# EasyEDA Pro project pet_dispenser.eprj

# Schematic Schematic1
Board Name: Board1; Create Date: 2026-09-30; Page Name: P1; Project Name: pet_dispenser; Schematic Name: Schematic1; Update Date: 2026-10-01; Company: EasyEDA.com; Page Size: A4; Version: V1.0
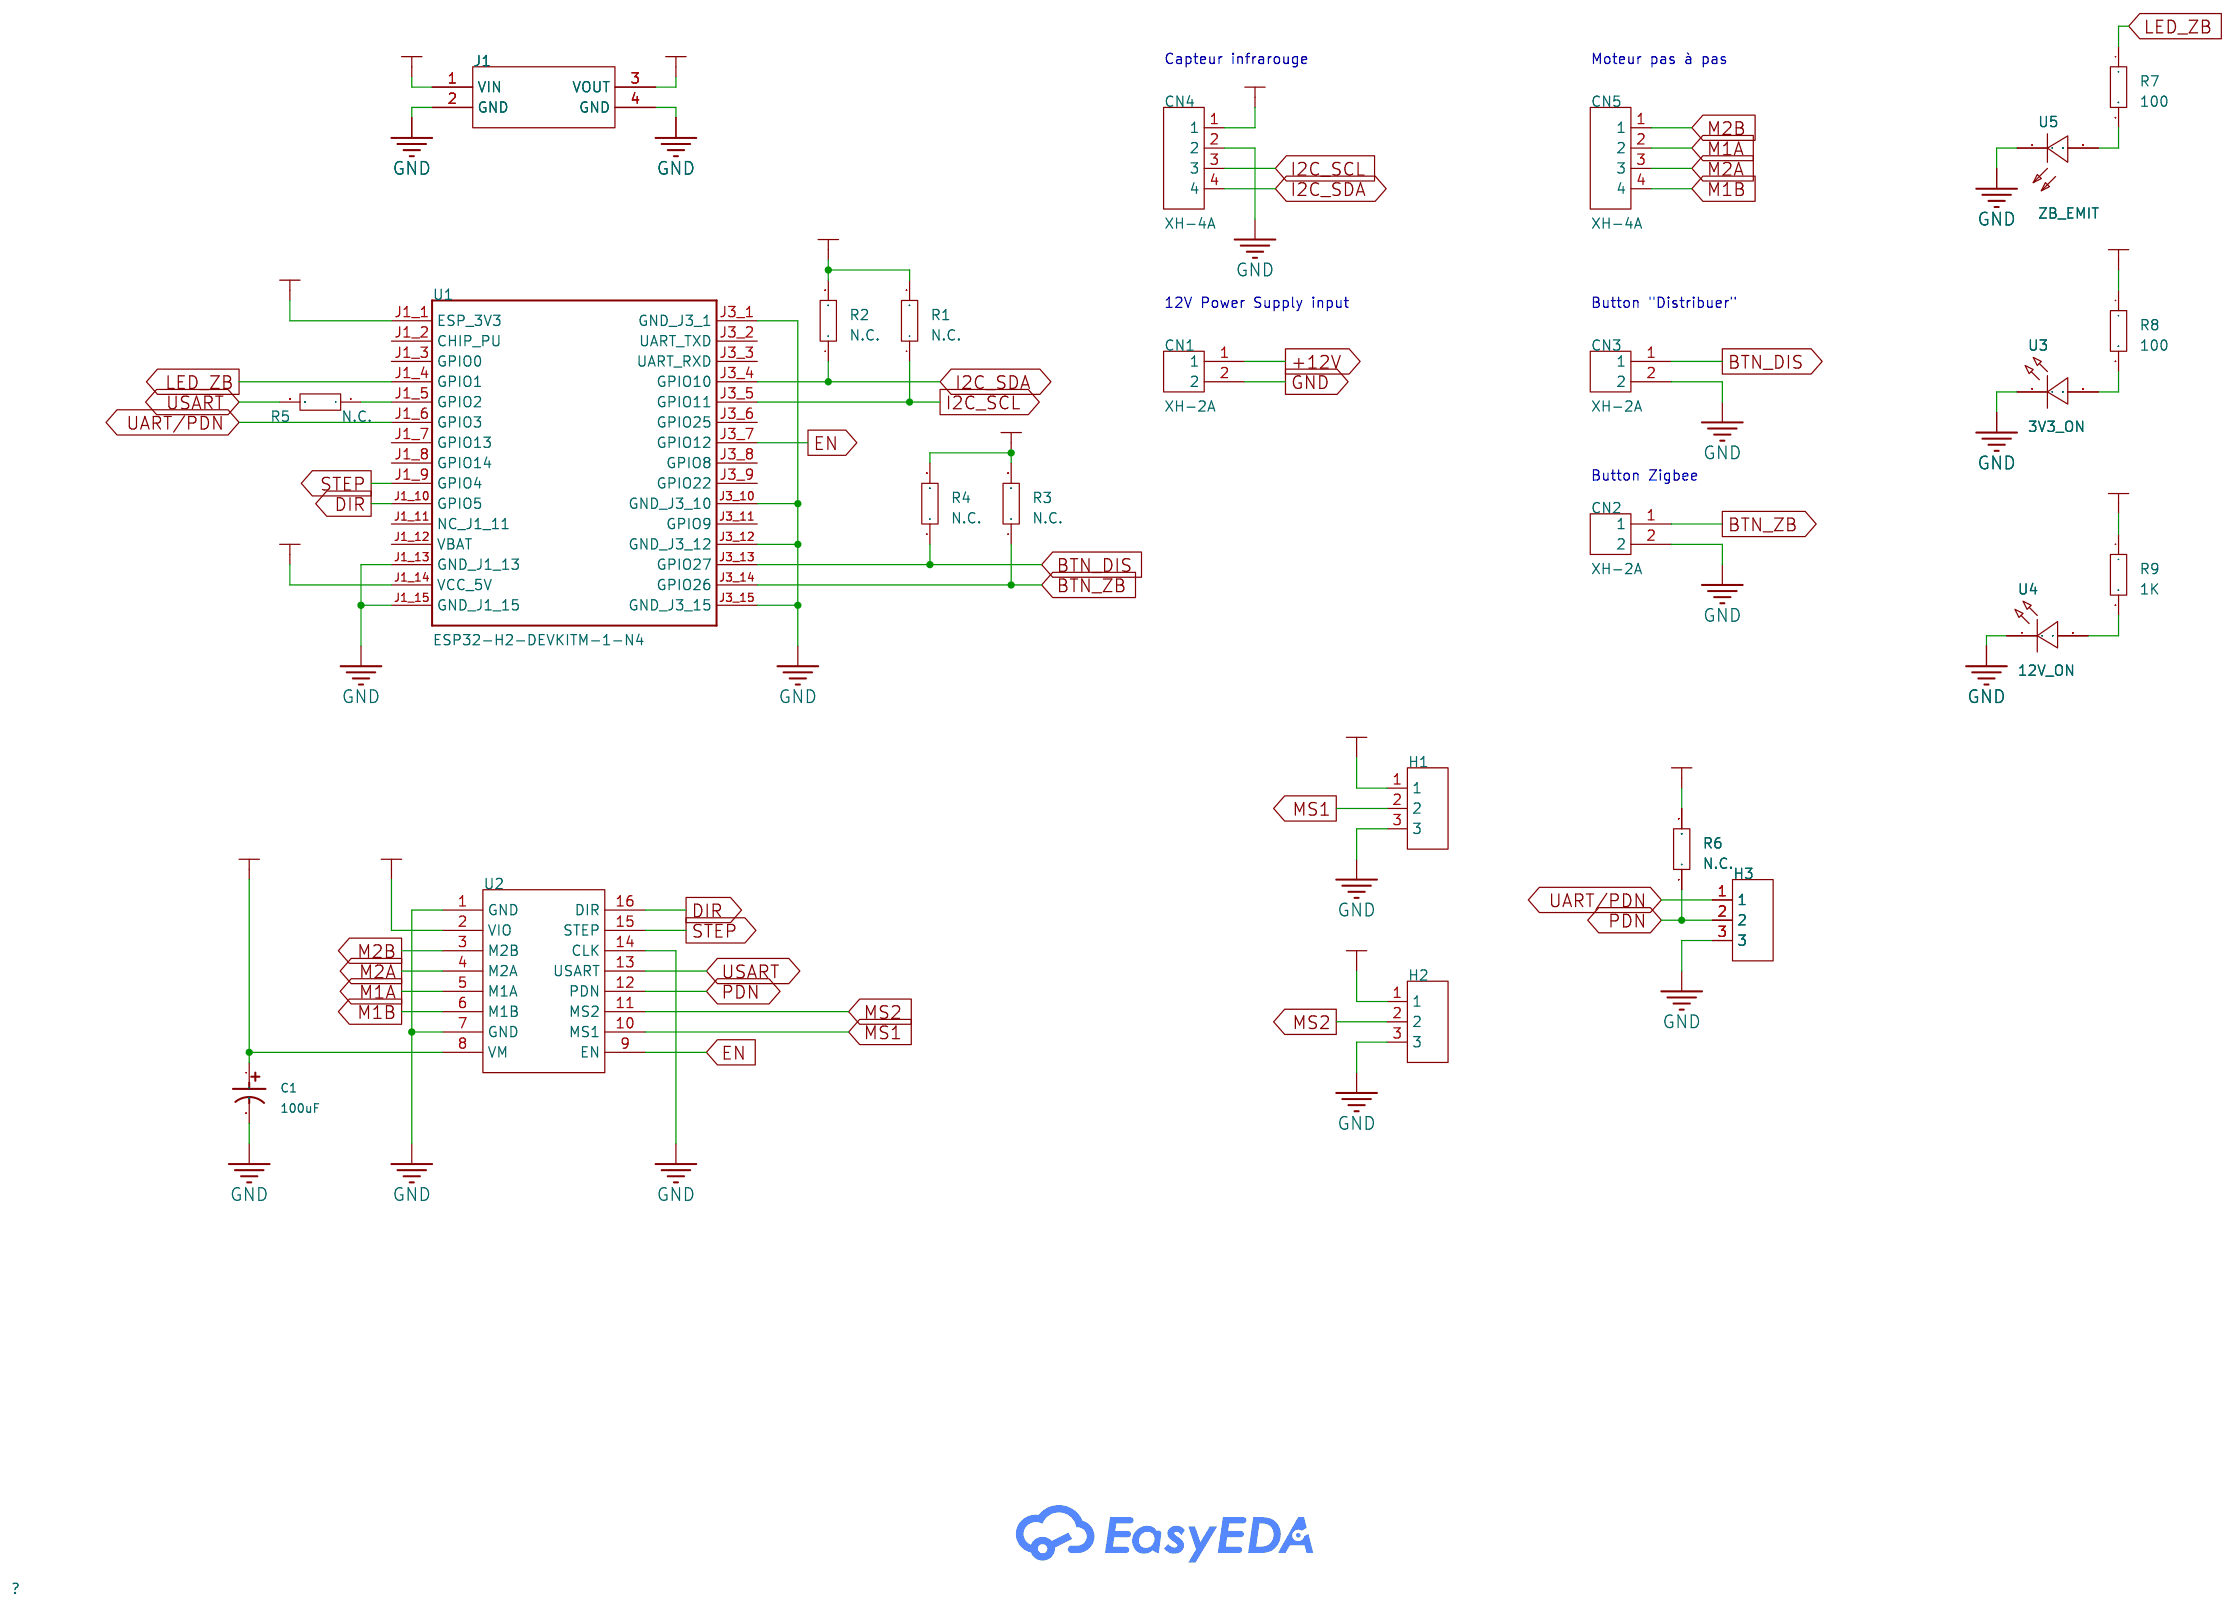
[diagram p0: schematic sheet]

## Parts
C1  100uF  [CAP-TH_BD8.0-P3.50-D0.6-FD-H12.0]
CN1  XH-2A  [CONN-TH_XH-2A]
CN2  XH-2A  [CONN-TH_XH-2A]
CN3  XH-2A  [CONN-TH_XH-2A]
CN4  XH-4A  [CONN-TH_4P-P2.50_4PIN]
CN5  XH-4A  [CONN-TH_4P-P2.50_4PIN]
H1  HX PH254-01-03-Z-L11.5 pcb pin header  [HDR-TH_3P-P2.54-V-M-1]
H2  HX PH254-01-03-Z-L11.5 pcb pin header  [HDR-TH_3P-P2.54-V-M-1]
H3  HX PH254-01-03-Z-L11.5 pcb pin header  [HDR-TH_3P-P2.54-V-M-1]
J1  -  [LM2596S]
R1  N.C.  [RES-TH_BD2.4-L6.3-P10.30-D0.6]
R2  N.C.  [RES-TH_BD2.4-L6.3-P10.30-D0.6]
R3  N.C.  [RES-TH_BD2.4-L6.3-P10.30-D0.6]
R4  N.C.  [RES-TH_BD2.4-L6.3-P10.30-D0.6]
R5  N.C.  [RES-TH_BD2.4-L6.3-P10.30-D0.6]
R6  N.C.  [RES-TH_BD2.4-L6.3-P10.30-D0.6]
R7  100  [RES-TH_BD2.4-L6.3-P10.30-D0.6]
R8  100  [RES-TH_BD2.4-L6.3-P10.30-D0.6]
R9  1K  [RES-TH_BD2.4-L6.3-P10.30-D0.6]
U1  ESP32-H2-DEVKITM-1-N4  [MODULE_ESP32-H2-DEVKITM-1-N4]
U2  -  [TMC2209-radiator]
U3  3V3_ON  [LED-TH_BD3.9-P2.54-RD]
U4  12V_ON  [LED-TH_BD3.9-P2.54-RD]
U5  ZB_EMIT  [LED-TH_BD4.0-P2.00-D0.5-RD_BULE]

## Library data of the parts
C1 = ERS1HM101F12OT: LCSC Part Name: 100uF ±20% 50V; Supplier Part: C112510; Manufacturer: AISHI(艾华集团); Supplier Footprint: 插件,D8xL12mm; JLCPCB Part Class: Extended Part; Datasheet: https://item.szlcsc.com/datasheet/ERS1HM101F12OT/113743.html; Supplier: LCSC; Tolerance: ±20%; Voltage Rating: 50V; Pin Spacing: 3.5mm; Diameter: 8mm; Height - Seated (Max): 12mm; Lifetime: 7000hrs@105℃
CN1-CN3 = XH-2A_C20079: LCSC Part Name: 1x2P 间距:2.5mm 直插 系列:XH; Supplier Part: C20079; Manufacturer: BOOMELE(博穆精密); Supplier Footprint: 插件,P=2.5mm; JLCPCB Part Class: Extended Part; Datasheet: https://item.szlcsc.com/datasheet/XH-2A/20789.html; Supplier: LCSC; Pins Structure: 1x2P; Pitch: 2.5mm; Mounting Type: Through Hole; Reference Series: XH; Number of Pins: 2P; Number of Rows: 1; Number of PINs Per Row: 2; Color: White; Z-Height of the Board: 7mm; X-Length of Bottom Edge on Board (Spacing Line): 7.5mm; Y-Width of Bottom Edge on Board: 5.8mm
CN4 CN5 = XH-4A_C53055480: LCSC Part Name: 1x4P 间距:2.54mm 直插 系列:XH; Supplier Part: C53055480; Manufacturer: LXWCONN(连兴旺电子); Supplier Footprint: 插件,P=2.5mm; JLCPCB Part Class: Extended Part; Datasheet: https://item.szlcsc.com/datasheet/XH-4A/55999680.html; Supplier: LCSC; Pins Structure: 1x4P; Pitch: 2.54mm; Mounting Type: Through Hole; Reference Series: XH; Number of Pins: 4P; Number of Rows: 1; Number of PINs Per Row: 4; Current Rating: 3A; Contact Material: Brass; Contact Plating: Tin; Operating Temperature: -25℃~+85℃; Voltage Rating: 250V; Plastic Material: PA66; Flame Retardant Rating: UL94V-0
H1-H3 = HX PH254-01-03-Z-L11.5 pcb pin header: LCSC Part Name: 1x3P 间距:2.54mm 方针 直插; Supplier Part: C52016391; Manufacturer: hanxia(韩下); Supplier Footprint: 插件,P=2.54mm; JLCPCB Part Class: Extended Part; Datasheet: https://item.szlcsc.com/datasheet/HX%2520PH254-01-03-Z-L11.5%2520pcb%2520pin%2520header/54760436.html; Supplier: LCSC; Pin Structure: 1x3P; Pitch: 2.54mm; Circluar Pins/Square Pins: Pin Header; Mounting Type: Through Hole; Number of Rows: 1; Number of Pins: 3P; Current Rating: 3A; Voltage Rating (Max): 1kV; Length of Mating Pin: 6mm; Insulation Height: 2.5mm; Length of End Connection Pin: 3mm; Contact Material: Brass; Contact Plating: Gold; Operating Temperature: -40℃~+105℃
J1 = LM2596S
R1-R9 = MFR-25FTE52-4K7: Type:Metal Film Resistors Resistance: Tolerance:±1% Tolerance:±1% Power(Watts):250mW Temperature Coefficient:±50ppm/℃ Temperature Coefficient:±50ppm/℃ Operating Temperature:-55℃~+155℃ Operating Temperature:-55℃~+155℃; LCSC Part Name: 金属膜电阻 4.7kΩ ±1% 250mW 铜脚，圆柱状直插; Supplier Part: C173023; Manufacturer: YAGEO(国巨); Supplier Footprint: 插件,D2.4xL6.3mm; JLCPCB Part Class: Extended Part; Datasheet: https://atta.szlcsc.com/upload/public/pdf/source/20191118/C457825_18355E864DE4965678DC27B0EBC3E21E.pdf; Supplier: LCSC; Type: Metal Film Resistors; Tolerance: ±1%; Power(Watts): 250mW; Temperature Coefficient: ±50ppm/℃; Operating Temperature: -55℃~+155℃
U1 = ESP32-H2-DEVKITM-1-N4
U2 = TMC2209-radiator
U3 U4 = greenled_m3: Supplier Part: C9900094809; Supplier Footprint: LED-TH_BD3.90-P2.54; JLCPCB Part Class: Extended Part; Supplier: LCSC
U5 = LED-DIP-3MM_Blue: Supplier Part: C9900002363; Supplier Footprint: LED-TH_BD4.1-P2.00; JLCPCB Part Class: Extended Part; Supplier: LCSC

## Nets
+3V3: CN4.1 H1.1 H2.1 R1.2 R2.2 R3.2 R4.2 R6.2 R8.1 U1.J1_1(ESP_3V3) U2.2(VIO)
+5V: J1.3(VOUT) U1.J1_14(VCC_5V)
+12V: C1.1 CN1.1 J1.1(VIN) R9.1 U2.8(VM)
GND: C1.2 CN1.2 CN2.2 CN3.2 CN4.2 H1.3 H2.3 H3.3 J1.2(GND) J1.4(GND) U1.J1_13(GND) U1.J1_15(GND) U1.J3_1(GND) U1.J3_10(GND) U1.J3_12(GND) U1.J3_15(GND) U2.1(GND) U2.7(GND) U2.14(CLK) U3.1 U4.1 U5.1
BTN_DIS: CN3.1 R4.1 U1.J3_13(GPIO27)
BTN_ZB: CN2.1 R3.1 U1.J3_14(GPIO26)
DIR: U1.J1_10(GPIO5) U2.16(DIR)
EN: U1.J3_7(GPIO12) U2.9(EN)
I2C_SCL: CN4.3 R1.1 U1.J3_5(GPIO11)
I2C_SDA: CN4.4 R2.1 U1.J3_4(GPIO10)
LED_ZB: R7.1 U1.J1_4(GPIO1)
M1A: CN5.2 U2.5(M1A)
M1B: CN5.4 U2.6(M1B)
M2A: CN5.3 U2.4(M2A)
M2B: CN5.1 U2.3(M2B)
MS1: H1.2 U2.10(MS1)
MS2: H2.2 U2.11(MS2)
PDN: H3.2 R6.1 U2.12(PDN)
STEP: U1.J1_9(GPIO4) U2.15(STEP)
UART/PDN: H3.1 U1.J1_6(GPIO3)
USART: R5.2 U2.13(USART)
$1N2665: R5.1 U1.J1_5(GPIO2)
$1N3525: R7.2 U5.2
$1N3546: R8.2 U3.2
$1N3565: R9.2 U4.2

Not connected (* = marked no-connect by the designer): U1 J1_2(CHIP_PU) J1_3(GPIO0) J1_7(GPIO13) J1_8(GPIO14) J1_11(NC) J1_12(VBAT) J3_2(UART_TXD) J3_3(UART_RXD) J3_6(GPIO25) J3_8(GPIO8) J3_9(GPIO22) J3_11(GPIO9)

## Notes on the sheet
- Capteur infrarouge
- Moteur pas à pas
- 12V Power Supply input
- Button "Distribuer"
- Button Zigbee

# Board PCB1
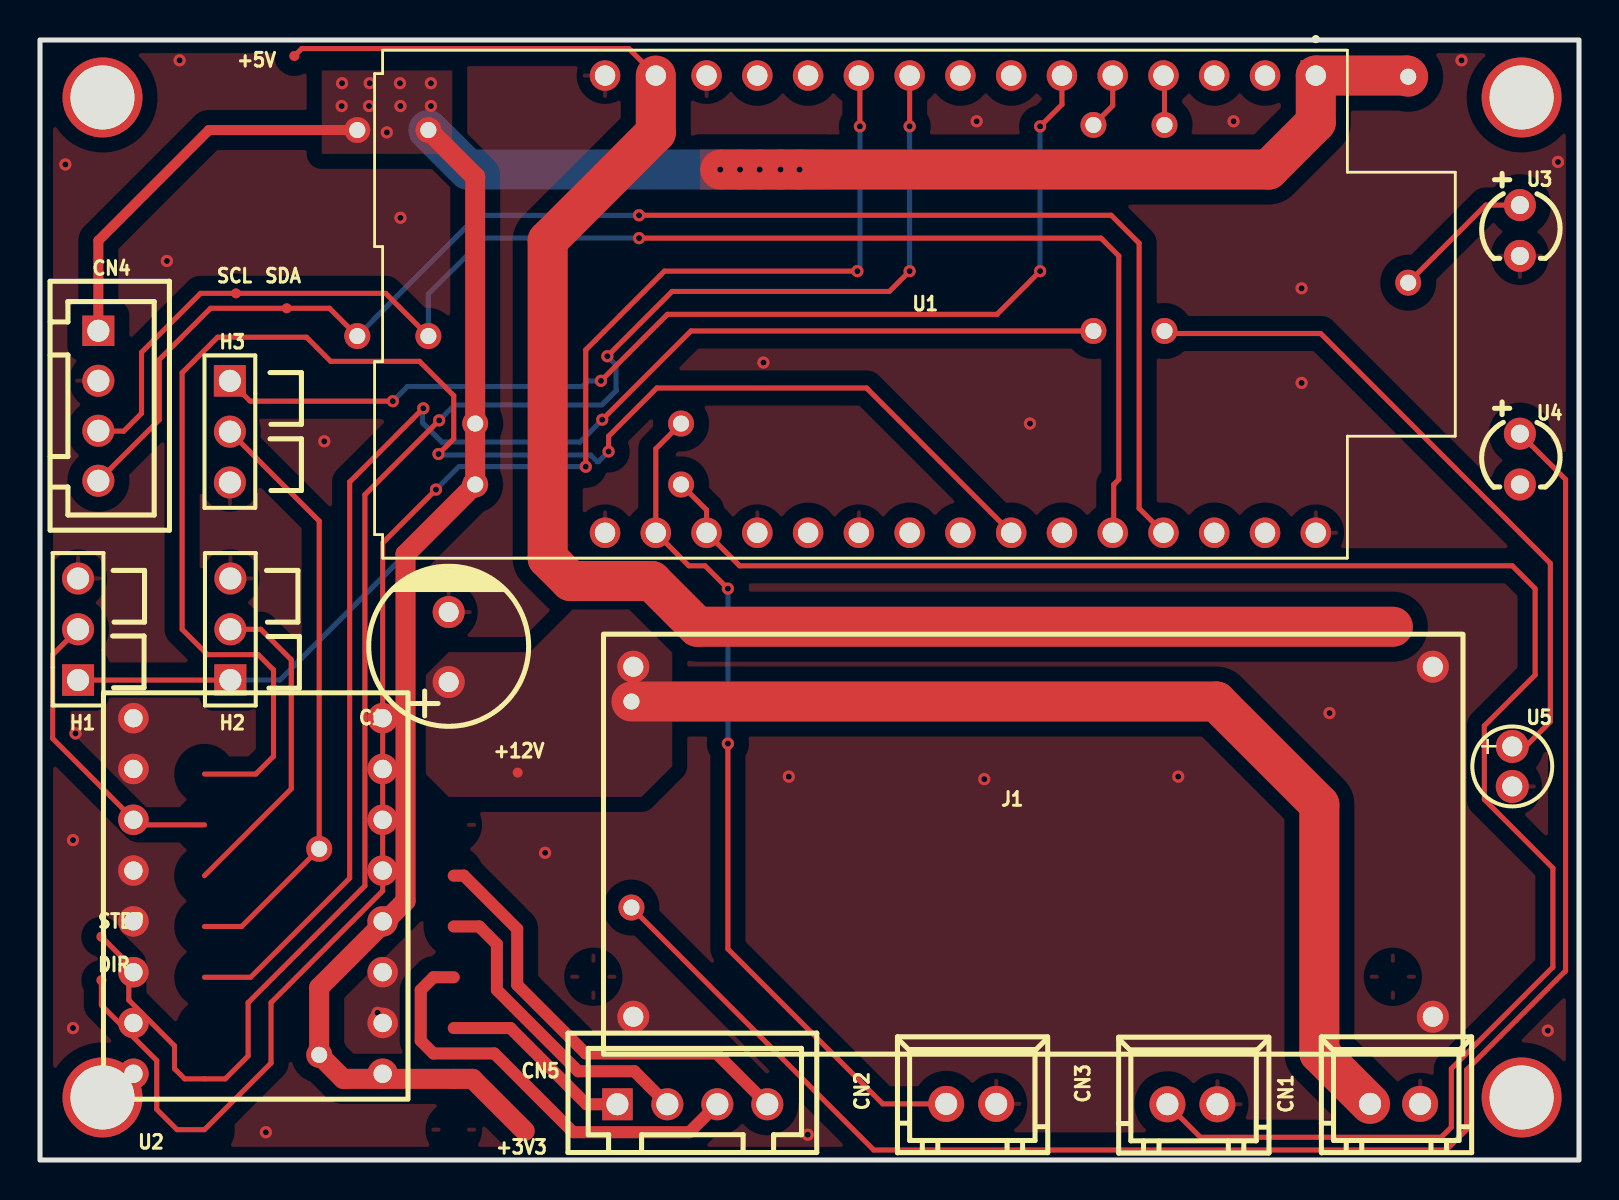
[diagram p1: board, top side]
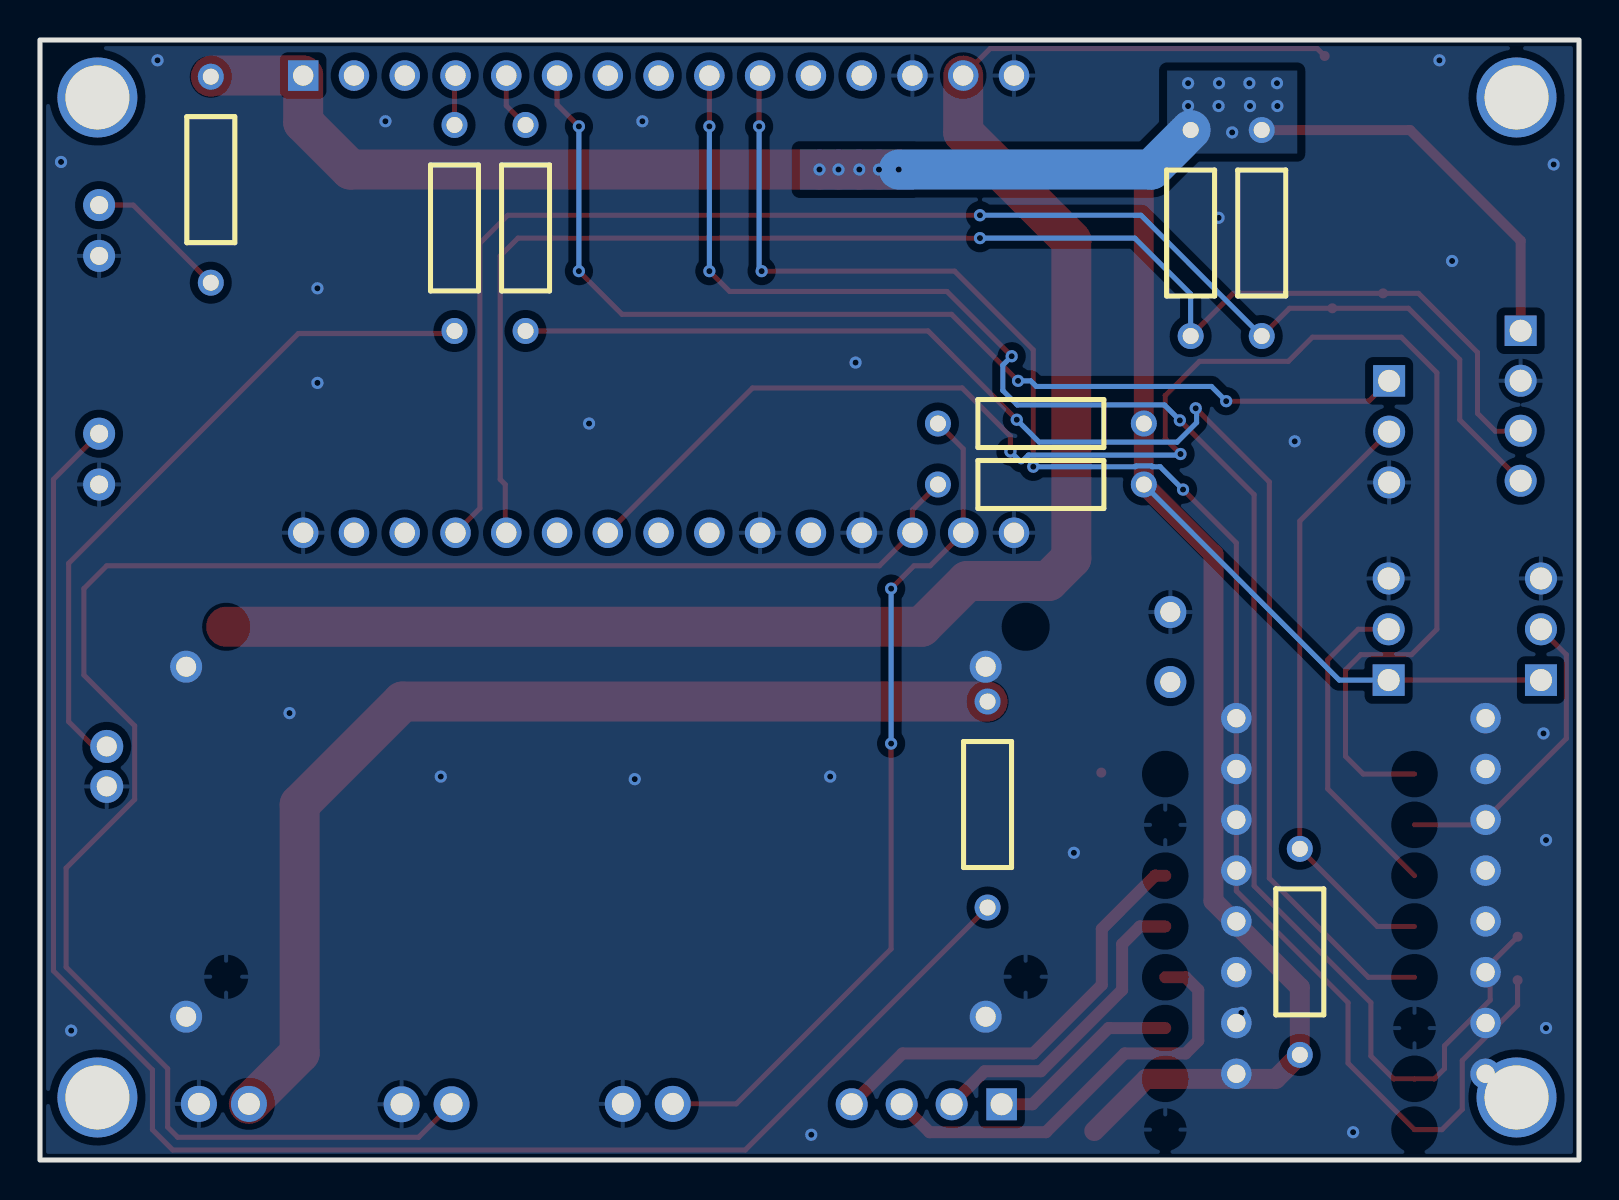
[diagram p2: board, bottom side, seen from below]

Outline 77 x 56 mm; copper layers: Top Layer, Bottom Layer. Coordinates in mm from the lower left corner of the outline.
Outline path: rectangle 0,56 77,0
Stack: Top Layer 0.035mm / Dielectric1 1.51mm FR4 er 4.5 / Bottom Layer 0.035mm

## Design rules (mm)
template: Custom Config
spacing copperThickness1oz (default): track to track 0.102, other pairs 0.152 to 0.3
spacing copperThickness2oz: track to track 0.203, other pairs 0.152 to 0.3
track width copperThickness1oz (default): min 0.127, default 0.254, max 2.54
track width copperThickness2oz: min 0.203, default 0.254, max 2.54
differential pair differentialPair (default): width min 0.127, default 0.254, max 2.54; gap min 0.152, default 0.152
via viaSize (default): diameter min 0.5, default 0.61, max 10; hole min 0.3, default 0.305, max 6.3

## Placement (name value [footprint] x y rotation side)
+3V3  -  [Test-Point-0.5mm]  24.25 1.45 0 top
+5V  -  [Test-Point-0.5mm]  12.73 55.2 0 top
+12V  -  [Test-Point-0.5mm]  23.9 19.37 0 top
C1  100uF  [CAP-TH_BD8.0-P3.50-D0.6-FD-H12.0]  20.45 25.65 90 top
CN1  XH-2A  [CONN-TH_XH-2A]  67.8 2.81 0 top
CN2  XH-2A  [CONN-TH_XH-2A]  46.59 2.81 0 top
CN3  XH-2A  [CONN-TH_XH-2A]  57.66 2.79 0 top
CN4  XH-4A  [CONN-TH_4P-P2.50_4PIN]  2.92 37.71 270 top
CN5  XH-4A  [CONN-TH_4P-P2.50_4PIN]  32.64 2.79 0 top
DIR  -  [Test-Point-0.5mm]  3.07 8.99 0 top
H1  HX PH254-01-03-Z-L11.5 pcb pin header  [HDR-TH_3P-P2.54-V-M-1]  1.91 26.54 90 top
H2  HX PH254-01-03-Z-L11.5 pcb pin header  [HDR-TH_3P-P2.54-V-M-1]  9.52 26.54 90 top
H3  HX PH254-01-03-Z-L11.5 pcb pin header  [HDR-TH_3P-P2.54-V-M-1]  9.5 36.42 270 top
J1  -  [LM2596S]  27.69 26.66 0 top
NOREF  -  [Pad_e28]  3.13 3.13 0 top
NOREF#2  -  [Pad_e29]  74.13 53.13 0 top
NOREF#3  -  [Pad_e30]  74.13 3.13 0 top
NOREF#4  -  [Pad_e26]  3.13 53.13 0 top
R1  N.C.  [RES-TH_BD2.4-L6.3-P10.30-D0.6]  19.43 46.35 90 bottom
R2  N.C.  [RES-TH_BD2.4-L6.3-P10.30-D0.6]  15.88 46.35 90 bottom
R3  N.C.  [RES-TH_BD2.4-L6.3-P10.30-D0.6]  26.92 36.82 180 bottom
R4  N.C.  [RES-TH_BD2.4-L6.3-P10.30-D0.6]  26.92 33.78 180 bottom
R5  N.C.  [RES-TH_BD2.4-L6.3-P10.30-D0.6]  52.7 46.6 270 bottom
R6  N.C.  [RES-TH_BD2.4-L6.3-P10.30-D0.6]  13.97 10.41 270 bottom
R7  100  [RES-TH_BD2.4-L6.3-P10.30-D0.6]  56.26 46.6 270 bottom
R8  100  [RES-TH_BD2.4-L6.3-P10.30-D0.6]  68.45 49.02 270 bottom
R9  1K  [RES-TH_BD2.4-L6.3-P10.30-D0.6]  29.59 17.77 270 bottom
SCL  -  [Test-Point-0.5mm]  9.8 43.33 0 top
SDA  -  [Test-Point-0.5mm]  12.34 42.59 0 top
STEP  -  [Test-Point-0.5mm]  3.07 11.16 0 top
U1  ESP32-H2-DEVKITM-1-N4  [MODULE_ESP32-H2-DEVKITM-1-N4]  41.27 42.79 270 top
U2  -  [TMC2209-radiator]  20.7 1.52 180 top
U3  3V3_ON  [LED-TH_BD3.9-P2.54-RD]  74.04 46.48 90 top
U4  12V_ON  [LED-TH_BD3.9-P2.54-RD]  74.04 35.05 90 top
U5  ZB_EMIT  [LED-TH_BD4.0-P2.00-D0.5-RD_BULE]  73.66 19.68 90 top

## Footprints (pads in the part's own frame, mm; a bottom-side part is the same pattern mirrored in y, then rotated)
CAP-TH_BD8.0-P3.50-D0.6-FD-H12.0
  round 1.6 hole 1: 1(-1.75,0) 2(1.75,0)
CONN-TH_4P-P2.50_4PIN
  rect 1.524x1.6 hole 1.1: 1(-3.75,0)
  round 1.6 hole 1.1: 2(-1.25,0) 3(1.25,0) 4(3.75,0)
CONN-TH_XH-2A
  round 1.8 hole 1.1: 1(-1.251,0) 2(1.251,0)
HDR-TH_3P-P2.54-V-M-1
  rect 1.575x1.6 hole 1.1: 1(-2.54,0)
  round 1.6 hole 1.1: 2(0,0) 3(2.54,0)
LED-TH_BD3.9-P2.54-RD
  round 1.6 hole 0.9: 1(-1.27,0) 2(1.27,0)
LED-TH_BD4.0-P2.00-D0.5-RD_BULE
  round 1.65 hole 1: 1(-1,0) 2(1,0)
LM2596S
  round 1.6 hole 1: 1(2,-2) 2(2,-19.5) 3(42,-2) 4(42,-19.5)
MODULE_ESP32-H2-DEVKITM-1-N4
  rect 1.524x1.524 hole 1.016: J1_1(-11.43,22.555)
  round 1.524 hole 1.016: J1_2(-11.43,20.015) J1_3(-11.43,17.475) J1_4(-11.43,14.935) J1_5(-11.43,12.395) J1_6(-11.43,9.855) J1_7(-11.43,7.315) J1_8(-11.43,4.775) J1_9(-11.43,2.235) J1_10(-11.43,-0.305) J1_11(-11.43,-2.845) J1_12(-11.43,-5.385) J1_13(-11.43,-7.925) J1_14(-11.43,-10.465) J1_15(-11.43,-13.005) J3_1(11.43,22.555) J3_2(11.43,20.015) J3_3(11.43,17.475) J3_4(11.43,14.935) J3_5(11.43,12.395) J3_6(11.43,9.855) J3_7(11.43,7.315) J3_8(11.43,4.775) J3_9(11.43,2.235) J3_10(11.43,-0.305) J3_11(11.43,-2.845) J3_12(11.43,-5.385) J3_13(11.43,-7.925) J3_14(11.43,-10.465) J3_15(11.43,-13.005)
Pad_e26
  round 4 hole 3.2: (0,0)
Pad_e28
  round 4 hole 3.2: (0,0)
Pad_e29
  round 4 hole 3.2: (0,0)
Pad_e30
  round 4 hole 3.2: (0,0)
RES-TH_BD2.4-L6.3-P10.30-D0.6
  round 1.3 hole 0.8: 1(-5.15,0) 2(5.15,0)
Test-Point-0.5mm
  round 0.5 smd: 1(0,0)
TMC2209-radiator
  round 1.524 hole 0.914: 1(3.556,-2.794) 2(3.556,-5.334) 3(3.556,-7.874) 4(3.556,-10.414) 5(3.556,-12.954) 6(3.556,-15.494) 7(3.556,-18.034) 8(3.556,-20.574) 9(16.026,-20.574) 10(16.026,-18.034) 11(16.026,-15.494) 12(16.026,-12.954) 13(16.026,-10.414) 14(16.026,-7.874) 15(16.026,-5.334) 16(16.026,-2.794)

## Nets
+3V3: +3V3.1 CN4.1 H1.1 H2.1 R1.2 R2.2 R3.2 R4.2 R6.2 R8.1 U1.J1_1 U2.2
+5V: +5V.1 J1.3 U1.J1_14
+12V: +12V.1 C1.1 CN1.1 J1.1 R9.1 U2.8
GND: C1.2 CN1.2 CN2.2 CN3.2 CN4.2 H1.3 H2.3 H3.3 J1.2 J1.4 U1.J1_13 U1.J1_15 U1.J3_1 U1.J3_10 U1.J3_12 U1.J3_15 U2.1 U2.7 U2.14 U3.1 U4.1 U5.1
BTN_DIS: CN3.1 R4.1 U1.J3_13
BTN_ZB: CN2.1 R3.1 U1.J3_14
DIR: DIR.1 U1.J1_10 U2.16
EN: U1.J3_7 U2.9
I2C_SCL: CN4.3 R1.1 SCL.1 U1.J3_5
I2C_SDA: CN4.4 R2.1 SDA.1 U1.J3_4
LED_ZB: R7.1 U1.J1_4
M1A: CN5.2 U2.5
M1B: CN5.4 U2.6
M2A: CN5.3 U2.4
M2B: CN5.1 U2.3
MS1: H1.2 U2.10
MS2: H2.2 U2.11
PDN: H3.2 R6.1 U2.12
STEP: STEP.1 U1.J1_9 U2.15
UART/PDN: H3.1 U1.J1_6
USART: R5.2 U2.13
$1N2665: R5.1 U1.J1_5
$1N3525: R7.2 U5.2
$1N3546: R8.2 U3.2
$1N3565: R9.2 U4.2

Pads without a net: U1 J1_2 J1_3 J1_7 J1_8 J1_11 J1_12 J3_2 J3_3 J3_6 J3_8 J3_9 J3_11

## Via types
v1: diameter 0.61, hole 0.305, Top Layer to Bottom Layer, 59 vias

## Routing (per net, layer and track width the routed paths; a pad name or vN(x,y) marks a point on that pad's centre or on a via; arc(x,y) is an arc through that point)
+3V3: length 159.2
  Top Layer w0.254: H1.1 H2.1
  Top Layer w0.5: CN4.1 2.92,45.97 8.45,51.5 R2.2
  Top Layer w1: R1.2 21.77,49.16 R3.2 R4.2 18.29,30.29 18.29,12.95 13.97,8.63 R6.2 15.17,4.06 21.65,4.06 +3V3.1
  Top Layer w2: v1(34.04,49.52) v1(35.03,49.52) v1(36.01,49.52) v1(37.05,49.52) v1(38,49.52) 61.47,49.52 63.83,51.89 U1.J1_1 68.4,54.22 R8.1
  Bottom Layer w0.254: H2.1 11.99,24 R4.2
  Bottom Layer w2: v1(34.04,49.52) 21.41,49.52 R1.2
  vias: v1(15.11,53.84) v1(15.09,52.7) v1(16.46,52.7) v1(16.49,53.84) v1(17.35,51.38) v1(18.01,53.84) v1(18.03,52.7) v1(19.56,53.84) v1(19.56,52.7)
+5V: length 88.9
  Top Layer w0.254: +5V.1 13.1,55.57 29.46,55.57 U1.J1_14
  Top Layer w2: 67.69,26.66 32.89,26.66 30.61,28.95 26.54,28.95 25.4,30.09 25.4,45.97 30.81,51.38 U1.J1_14
+12V: length 52.6
  Top Layer w2: R9.1 58.86,22.92 64.01,17.77 64.01,5.35 CN1.1
GND:
  vias: v1(1.27,49.78) v1(1.65,16) v1(1.65,6.6) v1(1.78,21.33) v1(6.35,44.95) v1(6.98,54.98) v1(11.3,1.39) v1(14.22,35.93) v1(16.89,7.36) v1(18.03,47.11) v1(25.27,15.36) v1(36.2,39.87) v1(37.46,19.17) v1(38.41,1.26) v1(46.86,51.94) v1(47.24,19.04) v1(49.53,36.82) v1(56.95,19.17) v1(59.72,51.94) v1(63.12,43.58) v1(63.12,38.86) v1(64.52,22.35) v1(71.12,54.98) v1(75.44,6.47) v1(75.95,49.9)
BTN_DIS: length 92.2
  Top Layer w0.254: R4.1 33.35,32.5 33.35,31.36 35,29.71 73.66,29.71 74.8,28.57 74.8,24.25 72.26,21.71 72.26,18.03 75.69,14.6 75.69,9.65 70.61,4.56 70.61,1.64 70.1,1.14 58.06,1.14 CN3.1
BTN_ZB: length 42.9
  Top Layer w0.254: CN2.1 42.16,2.81 34.42,10.55 v1(34.42,20.82) ; R3.1 30.81,35.56 U1.J3_14 32.46,29.71 33.27,29.71 v1(34.42,28.57)
  Bottom Layer w0.254: v1(34.42,20.82) v1(34.42,28.57)
DIR: length 86.1
  Top Layer w0.254: v1(27.3,34.66) 27.3,40.51 31.24,44.44 v1(40.89,44.44) ; v1(41.02,51.68) 41.02,54.17 U1.J1_10 ; v1(19.81,33.52) 17.14,30.85 17.14,13.46 11.56,7.87 11.56,4.84 8.23,1.52 6.86,1.52 5.84,2.53 5.84,4.97 3.07,7.74 DIR.1
  Bottom Layer w0.254: v1(19.81,33.52) 20.95,34.66 21.35,34.66 21.39,34.7 22.16,34.7 22.2,34.66 v1(27.3,34.66) ; v1(41.02,51.68) 41.02,44.57 v1(40.89,44.44)
EN: length 78.9
  Top Layer w0.254: v1(28.45,35.43) 28.45,36.19 30.86,38.6 41.35,38.6 U1.J3_7 ; 8.23,19.3 10.8,19.3 11.68,20.19 11.68,24.5 10.92,25.27 8.38,25.27 7.11,26.54 7.11,39.36 8.89,41.14 13.33,41.14 14.54,39.93 18.99,39.93 20.7,38.22 20.7,36.06 v1(19.94,35.3)
  Bottom Layer w0.254: v1(19.94,35.3) 19.99,35.25 27.55,35.25 27.88,34.92 27.94,34.92 v1(28.45,35.43)
I2C_SCL: length 74.2
  Top Layer w0.254: U1.J3_5 53.72,31.41 53.72,33.78 53.98,34.03 53.98,45.21 53.09,46.09 v1(29.97,46.09) ; R1.1 17.3,43.33 SCL.1 8.03,43.33 5.08,40.38 5.08,37.33 4.19,36.44 2.94,36.44 CN4.3
  Bottom Layer w0.254: R1.1 19.43,43.3 22.23,46.09 v1(29.97,46.09)
I2C_SDA: length 76
  Top Layer w0.254: R2.1 14.49,42.59 SDA.1 8.53,42.59 5.97,40.02 5.97,37.01 CN4.4 ; v1(29.97,47.24) 53.59,47.24 54.99,45.84 54.99,32.58 U1.J3_4
  Bottom Layer w0.254: v1(29.97,47.24) 21.91,47.24 R2.1
LED_ZB: length 2.5
  Top Layer w0.254: U1.J1_4 56.26,54.17 R7.1
M1A: length 15.7
  Top Layer w0.6: 20.7,11.68 21.97,11.68 22.86,10.79 22.86,8.5 26.92,4.44 29.74,4.44 CN5.2
M1B: length 22.1
  Top Layer w0.6: 20.7,14.22 21.21,14.22 23.88,11.55 23.88,8.76 27.3,5.33 33.85,5.33 CN5.4
M2A: length 21.8
  Top Layer w0.6: 20.7,9.14 19.68,9.14 19.05,8.5 19.05,5.96 19.68,5.33 22.73,5.33 26.67,1.39 32.49,1.39 CN5.3
M2B: length 9.8
  Top Layer w0.6: 20.7,6.6 23.54,6.6 27.35,2.79 CN5.1
MS1: length 15.4
  Top Layer w0.254: H1.2 0.63,25.27 0.63,21.08 4.95,16.76 8.23,16.76
MS2: length 16.3
  Top Layer w0.254: 8.23,14.22 12.57,18.56 12.57,25.01 11.05,26.54 H2.2
PDN: length 30.1
  Top Layer w0.254: 8.23,11.68 10.09,11.68 R6.1 13.97,31.95 H3.2
STEP: length 86.4
  Top Layer w0.254: U1.J1_9 v1(43.51,51.68) ; 28.32,40.13 v1(28.38,40.19) 31.62,43.43 42.49,43.43 v1(43.51,44.44) ; STEP.1 4.44,9.79 4.44,7.99 6.73,5.71 6.73,4.56 7.24,4.06 9.27,4.06 10.41,5.2 10.41,7.87 16.26,13.71 16.26,33.27 v1(19.97,36.98)
  Bottom Layer w0.254: v1(28.38,40.19) 28.83,39.74 28.83,38.47 28.11,37.75 20.74,37.75 v1(19.97,36.98) ; v1(43.51,51.68) v1(43.51,44.44)
UART/PDN: length 53.9
  Top Layer w0.254: v1(17.65,37.94) 10.52,37.94 H3.1 ; v1(50.04,51.68) 51.13,52.77 U1.J1_6 ; v1(28.07,38.96) 31.39,42.28 47.88,42.28 v1(50.04,44.44)
  Bottom Layer w0.254: v1(28.07,38.96) 27.43,38.96 27.15,38.68 18.39,38.68 v1(17.65,37.94) ; v1(50.04,51.68) v1(50.04,44.44)
USART: length 71.3
  Top Layer w0.254: R5.2 32.57,41.45 v1(28.13,37.01) ; 8.23,9.14 10.54,9.14 15.49,14.09 15.49,33.9 v1(19.18,37.59)
  Bottom Layer w0.254: v1(19.18,37.59) 19.13,37.54 19.13,36.87 20.11,35.89 27.01,35.89 v1(28.13,37.01)
$1N2665: length 2.9
  Top Layer w0.254: R5.1 53.67,52.72 U1.J1_5
$1N3525: length 34.5
  Top Layer w0.254: U5.2 74.33,20.68 75.56,21.92 75.56,29.83 64.07,41.33 56.39,41.33 R7.2
$1N3546: length 7.2
  Top Layer w0.254: U3.2 72.33,47.75 R8.2
$1N3565: length 85
  Top Layer w0.254: U4.2 76.33,34.03 76.33,9.46 71.37,4.51 71.37,1.52 70.36,0.5 41.71,0.5 R9.2

## Copper pours and planes (outline as drawn; the poured copper is in the pictures)
+3V3 on Top Layer: 14.1,54.48 20.62,54.48 20.62,50.31 14.1,50.31
+3V3 on Top Layer: 33.02,50.54 39.26,50.54 39.26,48.51 33.02,48.51
+3V3 on Bottom Layer: 14.1,54.48 20.61,54.48 20.61,50.32 14.1,50.32
+3V3 on Bottom Layer: 33.27,50.54 38.99,50.54 38.99,48.51 33.27,48.51
+12V on Top Layer: 19.3,27.53 31.63,27.53 31.63,18.15 19.3,18.15
GND on Top Layer: 0,56 77,56 77,0 0,0
GND on Bottom Layer: 0,56 77,56 77,0 0,0
